# EAGLE design surfaceTest (EAGLE 7.5.0)
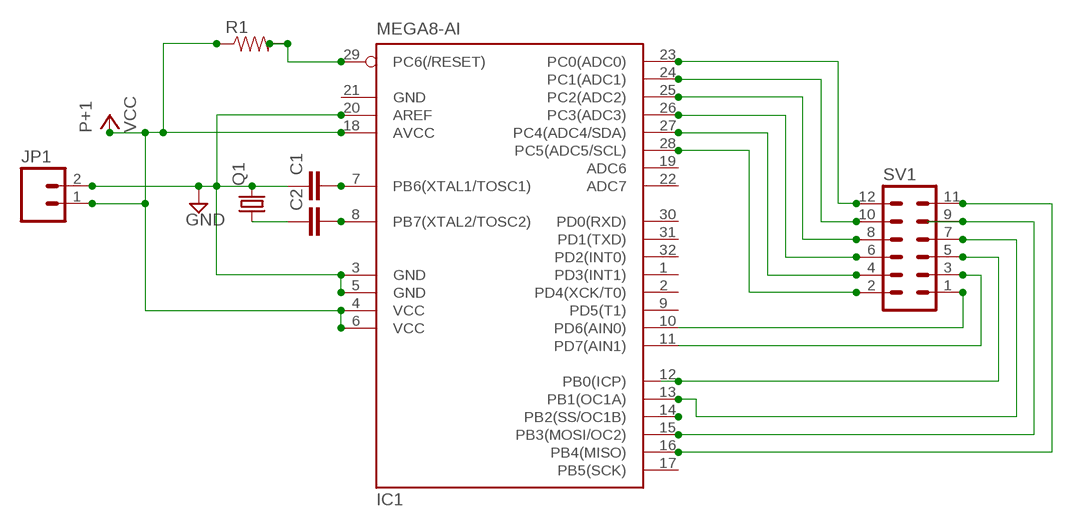
[diagram p0: schematic, sheet 1]

## Parts
C1  CAPPTH1  [CAP-PTH-5MM]
C2  CAPPTH1  [CAP-PTH-5MM]
IC1  MEGA8-AI  [TQFP32-08]
JP1  M02LOCK_LONGPADS  [1X02_LOCK_LONGPADS]
Q1  CRYSTALHC18U-V  [HC18U-V]
R1  RESISTORAXIAL-0.3  [AXIAL-0.3]
SV1  MA06-2  [MA06-2]

## Nets
GND: C1.1 IC1.3(GND) IC1.5(GND) IC1.20(AREF) JP1.2 Q1.2
N$1: C1.2 IC1.7(PB6(XTAL1/TOSC1))
N$2: C2.2 IC1.8(PB7(XTAL2/TOSC2))
N$3: IC1.25(PC2(ADC2)) SV1.8
N$4: C2.1 Q1.1
N$5: IC1.23(PC0(ADC0)) SV1.12
N$6: IC1.24(PC1(ADC1)) SV1.10
N$7: IC1.26(PC3(ADC3)) SV1.6
N$8: IC1.27(PC4(ADC4/SDA)) SV1.4
N$9: IC1.28(PC5(ADC5/SCL)) SV1.2
N$10: IC1.10(PD6(AIN0)) SV1.1
N$11: IC1.11(PD7(AIN1)) SV1.3
N$12: IC1.12(PB0(ICP)) SV1.5
N$13: IC1.13(PB1(OC1A)) SV1.7
N$14: IC1.15(PB3(MOSI/OC2)) SV1.9
N$15: IC1.16(PB4(MISO)) SV1.11
N$16: IC1.14(PB2(SS/OC1B))
N$18: IC1.29(PC6(/RESET)) R1.P$2
VCC: IC1.4(VCC) IC1.6(VCC) IC1.18(AVCC) JP1.1 R1.P$1
Unconnected: IC1.1(PD3(INT1)) IC1.2(PD4(XCK/T0)) IC1.9(PD5(T1)) IC1.17(PB5(SCK)) IC1.19(ADC6) IC1.22(ADC7) IC1.30(PD0(RXD)) IC1.31(PD1(TXD)) IC1.32(PD2(INT0))

## Power pins joined to a net without a drawn wire
GND: IC1.21(GND)

## Library data of the parts
C1 C2 = SparkFun:CAP: Capacitor Standard 0603 ceramic capacitor, and 0.1" leaded capacitor.
IC1 = atmel:MEGA8: MICROCONTROLLER 8 Kbytes FLASH, 1 kbytes SRAM, 512 bytes EEPROM, USART, 6-channel 10 bit ADC, 2-channel 8 bit ADC Pin compatible with Atmega48, ATMega88, ATMega168 Source: avr.lbr; MPN: ATMEGA8-16AU; OC_FARNELL: 9171371; OC_NEWARK: 73M8863
JP1 = SparkFun:M02: Header 2 Standard 2-pin 0.1" header. Use with straight break away headers (SKU : PRT-00116), right angle break away headers (PRT-00553), swiss pins (PRT-00743), machine pins (PRT-00117), and female headers (PRT-00115). Molex polarized connector foot print use with SKU : PRT-08233 with associated crimp pins and housings.
Q1 = adafruit:CRYSTAL: CRYSTAL; OC_FARNELL: unknown; OC_NEWARK: unknown
R1 = SparkFun:RESISTOR: Resistor Basic schematic elements and footprints for 0603, 1206, and PTH resistors.
SV1 = con-lstb:MA06-2: PIN HEADER; OC_FARNELL: unknown; OC_NEWARK: unknown

## Board
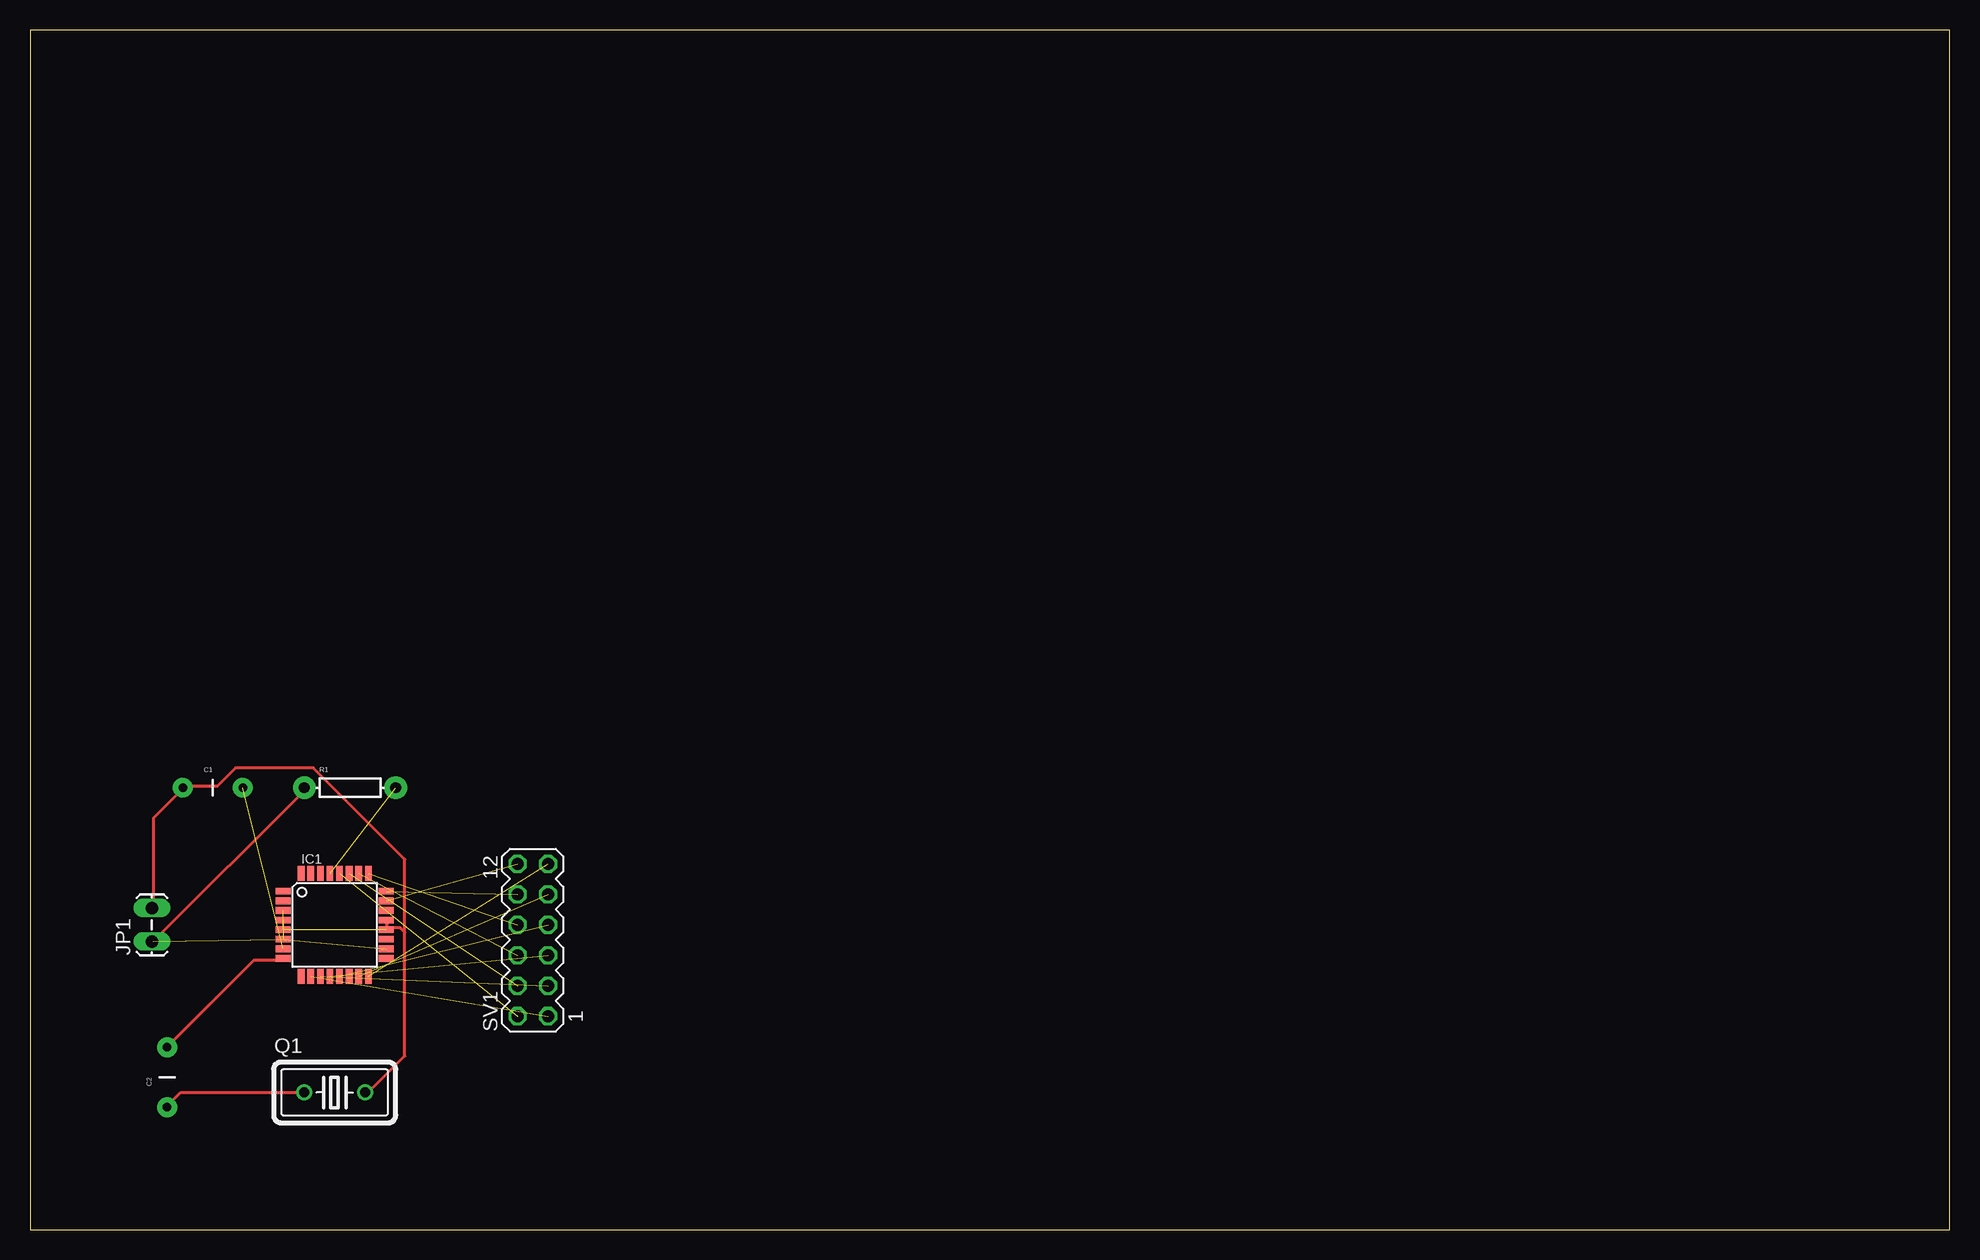
[diagram p1: board, top side]

Size 160 x 100 mm. Coordinates in mm from the lower left corner, seen from the top.
Outline: 0,0 160,0 160,100 0,100 0,0
Copper layers (1*16): Top 0.035mm / dielectric 1.5mm / Bottom 0.035mm
Design rules "default *": minimum track width 10mil, minimum drill 24mil, track to track 8mil, track to pad 8mil, pad to pad 8mil, via to via 8mil, smd to smd 8mil, copper to edge 40mil, drill to drill 8mil, minimum pad ring 10mil, minimum via ring 8mil, stop-mask expansion 4mil, vias tented up to drill 0mil, thermal gap 10mil

### Footprints (pad centres in the part's own frame; a part is rotated, then mirrored left to right if it is on the bottom)
CAP-PTH-5MM = drill 0.7 pad 1.651: 1 -2.5,0; 2 2.5,0
TQFP32-08 = smd 1.27 x 0.559: 1 -4.293,2.8; 2 -4.293,2; 3 -4.293,1.2; 4 -4.293,0.4; 5 -4.293,-0.4; 6 -4.293,-1.2; 7 -4.293,-2; 8 -4.293,-2.8; 17 4.293,-2.8; 18 4.293,-2; 19 4.293,-1.2; 20 4.293,-0.4; 21 4.293,0.4; 22 4.293,1.2; 23 4.293,2; 24 4.293,2.8 | smd 0.559 x 1.27: 9 -2.8,-4.293; 10 -2,-4.293; 11 -1.2,-4.293; 12 -0.4,-4.293; 13 0.4,-4.293; 14 1.2,-4.293; 15 2,-4.293; 16 2.8,-4.293; 25 2.8,4.293; 26 2,4.293; 27 1.2,4.293; 28 0.4,4.293; 29 -0.4,4.293; 30 -1.2,4.293; 31 -2,4.293; 32 -2.8,4.293
1X02_LOCK_LONGPADS = drill 1.016 long: 1 -0.127,0; 2 2.667,0
HC18U-V = drill 0.813: 1 -2.54,0; 2 2.54,0
AXIAL-0.3 = drill 0.9 pad 1.88: P$1 -3.81,0; P$2 3.81,0
MA06-2 = drill 1.016 octagon: 1 -6.35,-1.27; 2 -6.35,1.27; 3 -3.81,-1.27; 4 -3.81,1.27; 5 -1.27,-1.27; 6 -1.27,1.27; 7 1.27,-1.27; 8 1.27,1.27; 9 3.81,-1.27; 10 3.81,1.27; 11 6.35,-1.27; 12 6.35,1.27

### Placement (x,y rotation side)
C1  15.24,36.83 0 top
C2  11.43,12.7 90 top
IC1  25.4,25.4 0 top
JP1  10.16,24.13 90 top
Q1  25.4,11.43 0 top
R1  26.67,36.83 0 top
SV1  41.91,24.13 90 top

### Tracks (layer width: path | path; a pad name or v marks a point on that pad's centre or on a via)
GND  (2 unrouted)
  Top 0.254: JP1.2 10.29,27.05 10.29,34.29 12.57,36.58 C1.1 12.95,36.96 15.62,36.96 17.14,38.48 23.62,38.48 31.24,30.86 31.24,24.77 | 29.72,25.15 29.72,25.53 IC1.21 | 29.72,25.15 30.86,25.15 31.24,24.77 | 31.24,24.77 31.24,14.48 28.19,11.43 Q1.2 | 29.72,25.15 IC1.20
N$1  (1 unrouted)
N$2
  Top 0.254: IC1.8 20.95,22.48 18.67,22.48 11.43,15.24 C2.2
N$3  (1 unrouted)
N$4
  Top 0.254: Q1.1 12.57,11.43 11.43,10.29 C2.1
N$5  (1 unrouted)
N$6  (1 unrouted)
N$7  (1 unrouted)
N$8  (1 unrouted)
N$9  (1 unrouted)
N$10  (1 unrouted)
N$11  (1 unrouted)
N$12  (1 unrouted)
N$13  (1 unrouted)
N$14  (1 unrouted)
N$15  (1 unrouted)
N$18  (1 unrouted)
VCC  (3 unrouted)
  Top 0.254: JP1.1 10.29,24 22.86,36.58 R1.P$1